# Altium schematic sheet CameraSupplies.SchDoc
size 431 x 279 mm; Organization: ORGANIZATION; Address1: ADDRESS 1; Address2: ADDRESS 2; Address3: ADDRESS 3; Address4: ADDRESS 4; Revision: -; SheetNumber: 2; SheetTotal: 5; ENG_APP_DATE: --/--/--; DSN_APP_DATE: --/--/--; CHK_APP_DATE: --/--/--
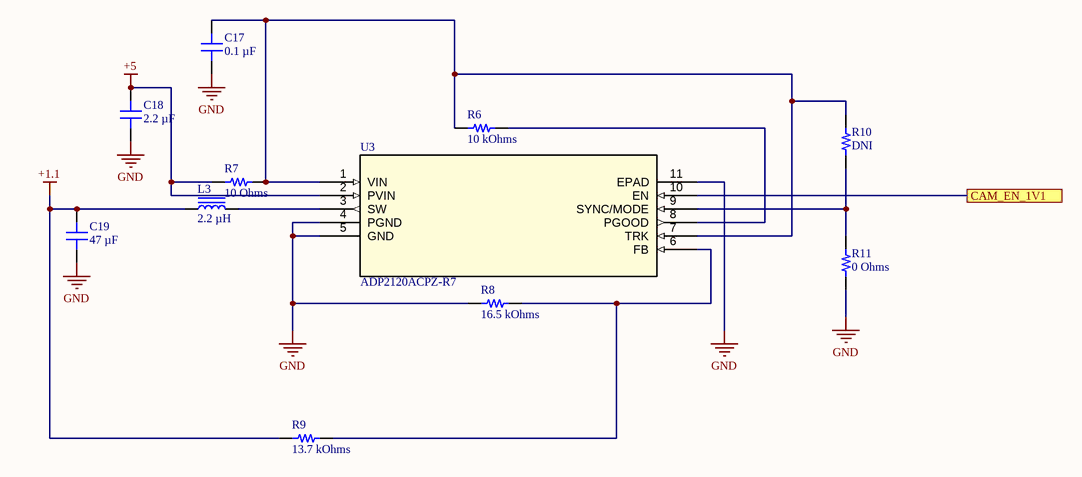
[diagram p0: CameraSupplies.SchDoc]

## Parts
C17  0.1 µF  [CAP 0201_0603]
C18  2.2 µF  [CAP 0402_1005]
C19  47 µF  [CAP 0603_1608]
L3  2.2 µH  [IND 0806_2016]
R6  10 kOhms  [RES 0201_0603]
R7  10 Ohms  [RES 0201_0603]
R8  16.5 kOhms  [RES 0201_0603]
R9  13.7 kOhms  [RES 0201_0603]
R10  DNI  [RES 0402_1005]
R11  0 Ohms  [RES 0402_1005]
U3  ADP2120ACPZ-R7  [CP_10_9_ADI]

## Ports
CAM_EN_1V1

## Nets
+1.1: C19.2 L3.1 R9.1
+5: C18.2 R7.1 U3.2(PVIN)
GND: C17.1 C18.1 C19.1 R8.1 R11.2 U3.4(PGND) U3.5(GND) U3.11(EPAD)
CAM_EN_1V1: U3.10(EN) ; port CAM_EN_1V1
NetC17_2: C17.2 R6.1 R7.2 R10.1 U3.1(VIN) U3.7(TRK)
NetL3_2: L3.2 U3.3(SW)
NetR6_2: R6.2 U3.8(PGOOD)
NetR8_2: R8.2 R9.2 U3.6(FB)
NetR10_2: R10.2 R11.1 U3.9(SYNC/MODE)

## Notes on the sheet
- DWG. NO.
- REV.
- SHT.
- REVISION
- DESCRIPTION
- DATE
- APPROVED
- ENG:
- APPROVALS
- PROJECT
- DSN:
- CHK:
- REFERENCE DOCUMENTS
- PROJECT REVISION:
- TITLE
- SimulaVR
- DOCUMENT REVISION:
- DESIGN ITEM:
- BOM:
- FAB DWG:
- PCB DWG:
- ASSY DWG:
- SCALE:
- SIZE
- B
- CAGE CODE
- FILE NAME
- DWG NO.
- SHEET
- OF
- REV

## Library data of the parts
C17 = GRM033R61A104KE15D: CAP CER 0.1UF 10V X5R 0201; manufacturer: Murata Electronics; Tolerance: ±10%; Part Number: GRM033R61A104KE15D; Value: 0.1 µF; Applications: General Purpose; Capacitance: 0.1 µF; componentlink1description: Datasheet; componentlink1url: https://www.murata.com/~/media/webrenewal/support/library/catalog/products/capacitor/mlcc/c02e.ashx?la=en-us; componentlink2description: DigiKey Link; componentlink2url: https://www.digikey.com/en/products/detail/murata-electronics/GRM033R61A104KE15D/2269163; Device Package: 0201 (0603 Metric); lastupdated: 2022-04-12 22:01:55; Lifecycle Status: Active; Minimum Order: 1; Mounting Type: Surface Mount, MLCC; Operating Temperature: -55°C ~ 85°C; Package / Case: 0201 (0603 Metric); packaging: CutTape; partid: 1641; Part Status: Active; price: 0.01; series: GRM; Size / Dimension: 0.024" L x 0.012" W (0.60mm x 0.30mm); Supplier 1: DigiKey; Supplier Part Number 1: 490-5881-1-ND; Temperature Coefficient: X5R; Thickness (Max): 0.013" (0.33mm); Voltage - Rated: 10V
C18 = GRM155R61C225ME44D: CAP CER 2.2UF 16V X5R 0402; manufacturer: Murata Electronics; Tolerance: ±20%; Part Number: GRM155R61C225ME44D; Value: 2.2 µF; Applications: General Purpose; Capacitance: 2.2 µF; componentlink1description: Datasheet; componentlink1url: https://search.murata.co.jp/Ceramy/image/img/A01X/G101/ENG/GRM155R61C225ME44-01.pdf; componentlink2description: DigiKey Link; componentlink2url: https://www.digikey.com/en/products/detail/murata-electronics/GRM155R61C225ME44D/5027541; Device Package: 0402 (1005 Metric); lastupdated: 2022-04-02 05:51:52; Lifecycle Status: Active; Minimum Order: 1; Mounting Type: Surface Mount, MLCC; Operating Temperature: -55°C ~ 85°C; Package / Case: 0402 (1005 Metric); packaging: TapeAndReel; partid: 4092; Part Status: Active; price: 0.03; series: GRM; Size / Dimension: 0.039" L x 0.020" W (1.00mm x 0.50mm); Supplier 1: DigiKey; Supplier Part Number 1: 490-10456-1-ND; Temperature Coefficient: X5R; Thickness (Max): 0.024" (0.60mm); Voltage - Rated: 16V
C19 = GRM188R60J476ME01D: CAP CER 47UF 6.3V X5R 0603; manufacturer: Murata Electronics; Tolerance: ±20%; Part Number: GRM188R60J476ME01D; Value: 47 µF; Applications: General Purpose; Capacitance: 47 µF; componentlink2description: DigiKey Link; componentlink2url: https://www.digikey.com/en/products/detail/murata-electronics/GRM188R60J476ME01D/13996874; Device Package: 0603 (1608 Metric); lastupdated: 5/20/2022 2:38:45 PM; Lifecycle Status: Active; Minimum Order: 1; Mounting Type: Surface Mount, MLCC; Operating Temperature: -55°C ~ 85°C; Package / Case: 0603 (1608 Metric); packaging: TapeAndReel; partid: 44498; Part Status: Active; price: 0.10; series: GRM; Size / Dimension: 0.063" L x 0.031" W (1.60mm x 0.80mm); Supplier 1: DigiKey; Supplier Part Number 1: 490-GRM188R60J476ME01DCT-ND; Temperature Coefficient: X5R; Thickness (Max): 0.039" (1.00mm); Voltage - Rated: 6.3V
L3 = 74479276222C: FIXED IND 2.2UH 1.6A 135MOHM SMD; Manufacturer: Würth Elektronik; Current - Saturation: 2.5A; DC Resistance (DCR): 135mOhm Max; Frequency - Self Resonant: 40MHz; Inductance Frequency - Test: 1 MHz; Material - Core: 0806 (2016 Metric); Shielding: Shielded; Tolerance: ±20%; Type: Molded; Part Number: 74479276222C; ComponentLink1Description: Datasheet; ComponentLink1URL: https://katalog.we-online.de/pbs/datasheet/74479276222C.pdf; ComponentLink2Description: DigiKey Link; ComponentLink2URL: https://www.digikey.com/en/products/detail/würth-elektronik/74479276222C/5870522; Current Rating (Amps): 1.6 A; Device Package: 0806 (2016 Metric); Height - Seated (Max): 0.039" (1.00mm); Inductance: 2.2 µH; LastUpdated: 5/23/2022 1:46:32 PM; Lifecycle Status: Active; Minimum Order: 1; Mounting Type: Surface Mount; Operating Temperature: -40°C ~ 125°C; Package / Case: 0806 (2016 Metric); Packaging: TapeAndReel; PartId: 2839; Part Status: Active; Price: 0.51; Series: WE-PMCI; Size / Dimension: 0.079" L x 0.063" W (2.00mm x 1.60mm); Supplier 1: DigiKey; Supplier Part Number 1: 732-9716-1-ND; Value: 2.2 µH
R6 = CRCW020110K0FKED: RES SMD 10K OHM 1% 1/20W 0201; Manufacturer: Vishay Dale; Power (Watts): 0.05W, 1/20W; Temperature Coefficient: ±100ppm/°C; Part Number: CRCW020110K0FKED; Value: 10 kOhms; ComponentLink1Description: Datasheet; ComponentLink1URL: http://www.vishay.com/docs/20052/crcw0201e3.pdf; ComponentLink2Description: DigiKey Link; ComponentLink2URL: https://www.digikey.com/en/products/detail/vishay-dale/CRCW020110K0FKED/1967989; Composition: Thick Film; Device Package: 0201 (0603 Metric); Height - Seated (Max): 0.010" (0.26mm); LastUpdated: 5/23/2022 1:02:37 PM; Lifecycle Status: Active; Minimum Order: 1; Number of Terminations: 2; Operating Temperature: -55°C ~ 155°C; Package / Case: 0201 (0603 Metric); Packaging: TapeAndReel; PartId: 29; Part Status: Active; Price: 0.03; Resistance: 10 kOhms; Series: CRCW; Size / Dimension: 0.024" L x 0.012" W (0.60mm x 0.30mm); Supplier 1: DigiKey; Supplier Part Number 1: 541-10.0KAABCT-ND; Supplier Device Package: 0201; Tolerance: ±1%
R7 = CRG0201F10R: RES SMD 10 OHM 1% 1/20W 0201; Manufacturer: TE Connectivity Passive Product; Power (Watts): 0.05W, 1/20W; Temperature Coefficient: ±400ppm/°C; Part Number: CRG0201F10R; Value: 10 Ohms; ComponentLink1Description: Datasheet; ComponentLink1URL: https://www.te.com/commerce/DocumentDelivery/DDEController?Action=srchrtrv&DocNm=1773204&DocType=DS&DocLang=English; ComponentLink2Description: DigiKey Link; ComponentLink2URL: https://www.digikey.com/en/products/detail/te-connectivity-passive-product/CRG0201F10R/4489648; Composition: Thick Film; Device Package: 0201 (0603 Metric); Height - Seated (Max): 0.010" (0.26mm); LastUpdated: 5/23/2022 1:02:37 PM; Lifecycle Status: Active; Minimum Order: 1; Number of Terminations: 2; Operating Temperature: -55°C ~ 155°C; Package / Case: 0201 (0603 Metric); Packaging: TapeAndReel; PartId: 3; Part Status: Active; Price: 0.03; Resistance: 10 Ohms; Series: CRG, Neohm; Size / Dimension: 0.024" L x 0.012" W (0.60mm x 0.30mm); Supplier 1: DigiKey; Supplier Part Number 1: A129573CT-ND; Supplier Device Package: 0201; Tolerance: ±1%
R8 = CRCW020116K5FNED: RES SMD 16.5K OHM 1% 1/20W 0201; Manufacturer: Vishay Dale; Power (Watts): 0.05W, 1/20W; Temperature Coefficient: ±200ppm/°C; Part Number: CRCW020116K5FNED; Value: 16.5 kOhms; ComponentLink1Description: Datasheet; ComponentLink1URL: http://www.vishay.com/docs/20052/crcw0201e3.pdf; ComponentLink2Description: DigiKey Link; ComponentLink2URL: https://www.digikey.com/en/products/detail/vishay-dale/CRCW020116K5FNED/1199935; Composition: Thick Film; Device Package: 0201 (0603 Metric); Height - Seated (Max): 0.011" (0.28mm); LastUpdated: 5/23/2022 1:02:31 PM; Lifecycle Status: Active; Minimum Order: 1; Number of Terminations: 2; Operating Temperature: -55°C ~ 155°C; Package / Case: 0201 (0603 Metric); Packaging: TapeAndReel; PartId: 1208; Part Status: Active; Price: 0.01; Resistance: 16.5 kOhms; Series: CRCW; Size / Dimension: 0.024" L x 0.012" W (0.60mm x 0.30mm); Supplier 1: DigiKey; Supplier Part Number 1: 541-CRCW020116K5FNEDCT-ND; Supplier Device Package: 0201; Tolerance: ±1%
R9 = RK73H1HTTC1372F: RES 13.7K OHM 1% 1/20W 0201; Manufacturer: KOA Speer Electronics, Inc.; Power (Watts): 0.05W, 1/20W; Temperature Coefficient: ±200ppm/°C; Part Number: RK73H1HTTC1372F; Value: 13.7 kOhms; ComponentLink1Description: Datasheet; ComponentLink1URL: http://www.koaspeer.com/catimages/Products/RK73H/RK73H.pdf; ComponentLink2Description: DigiKey Link; ComponentLink2URL: https://www.digikey.com/en/products/detail/koa-speer-electronics-inc/RK73H1HTTC1372F/9843939; Composition: Thick Film; Device Package: 0201 (0603 Metric); Features: Automotive AEC-Q200, Moisture Resistant; Height - Seated (Max): 0.010" (0.26mm); LastUpdated: 5/23/2022 1:02:37 PM; Lifecycle Status: Active; Minimum Order: 1; Number of Terminations: 2; Operating Temperature: -55°C ~ 155°C; Package / Case: 0201 (0603 Metric); Packaging: CutTape; PartId: 168; Part Status: Active; Price: 0.01; Ratings: AEC-Q200; Resistance: 13.7 kOhms; Series: RK73H; Size / Dimension: 0.024" L x 0.012" W (0.60mm x 0.30mm); Supplier 1: DigiKey; Supplier Part Number 1: 2019-RK73H1HTTC1372FCT-ND; Supplier Device Package: 0201; Tolerance: ±1%
R10 = CRCW04020000Z0EDHP: RES SMD 0 OHM JUMPER 1/5W 0402; Manufacturer: Vishay Dale; Power (Watts): 0.2W, 1/5W; Resistance: 0 Ohms; Part Number: CRCW04020000Z0EDHP; Value: DNI; ComponentLink1Description: Datasheet; ComponentLink1URL: http://www.vishay.com/docs/20043/crcwhpe3.pdf; ComponentLink2Description: DigiKey Link; ComponentLink2URL: http://digikey.com/product-detail/en/vishay-dale/CRCW04020000Z0EDHP/541-0.0YBCT-ND/2223008; Composition: Thick Film; Device Package: 0402 (1005 Metric); Features: Automotive AEC-Q200, Pulse Withstanding; Height - Seated (Max): 0.016" (0.40mm); LastUpdated: 2022-04-02 06:08:09; Lifecycle Status: Active; Minimum Order: 1; Number of Terminations: 2; Operating Temperature: -55°C ~ 155°C; Package / Case: 0402 (1005 Metric); Packaging: TapeAndReel; PartId: 3131; Part Status: Active; Price: 0.01; Ratings: AEC-Q200; Series: CRCW-HP; Size / Dimension: 0.039" L x 0.020" W (1.00mm x 0.50mm); Supplier 1: DigiKey; Supplier Part Number 1: 541-0.0YBCT-ND; Supplier Device Package: 0402; Tolerance: Jumper
R11 = CRCW04020000Z0EDHP: RES SMD 0 OHM JUMPER 1/5W 0402; Manufacturer: Vishay Dale; Power (Watts): 0.2W, 1/5W; Part Number: CRCW04020000Z0EDHP; Value: 0 Ohms; ComponentLink1Description: Datasheet; ComponentLink1URL: http://www.vishay.com/docs/20043/crcwhpe3.pdf; ComponentLink2Description: DigiKey Link; ComponentLink2URL: http://digikey.com/product-detail/en/vishay-dale/CRCW04020000Z0EDHP/541-0.0YBCT-ND/2223008; Composition: Thick Film; Device Package: 0402 (1005 Metric); Features: Automotive AEC-Q200, Pulse Withstanding; Height - Seated (Max): 0.016" (0.40mm); LastUpdated: 2022-04-02 06:08:09; Lifecycle Status: Active; Minimum Order: 1; Number of Terminations: 2; Operating Temperature: -55°C ~ 155°C; Package / Case: 0402 (1005 Metric); Packaging: TapeAndReel; PartId: 3131; Part Status: Active; Price: 0.01; Ratings: AEC-Q200; Resistance: 0 Ohms; Series: CRCW-HP; Size / Dimension: 0.039" L x 0.020" W (1.00mm x 0.50mm); Supplier 1: DigiKey; Supplier Part Number 1: 541-0.0YBCT-ND; Supplier Device Package: 0402; Tolerance: Jumper
U3 = CMP-011-000001-1: No Description Available; Mfr_Name: Analog Devices Inc; Source: ADP2120ACPZ-R7.SchLib; Design Item ID: ADP2120ACPZ-R7; RefDes: RefDes; Copyright: Copyright (C) 2022 Ultra Librarian. All rights reserved.; Manufacturer_Part_Number: ADP2120ACPZ-R7; Type: DEV